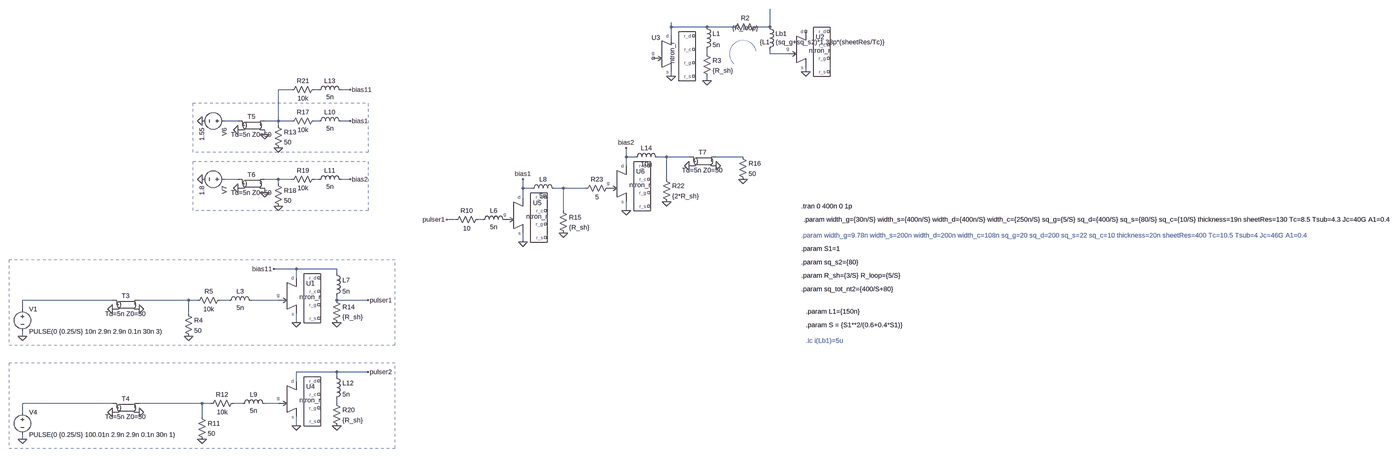
[diagram p0: schematic SNN_ntrons.asc, whole sheet]
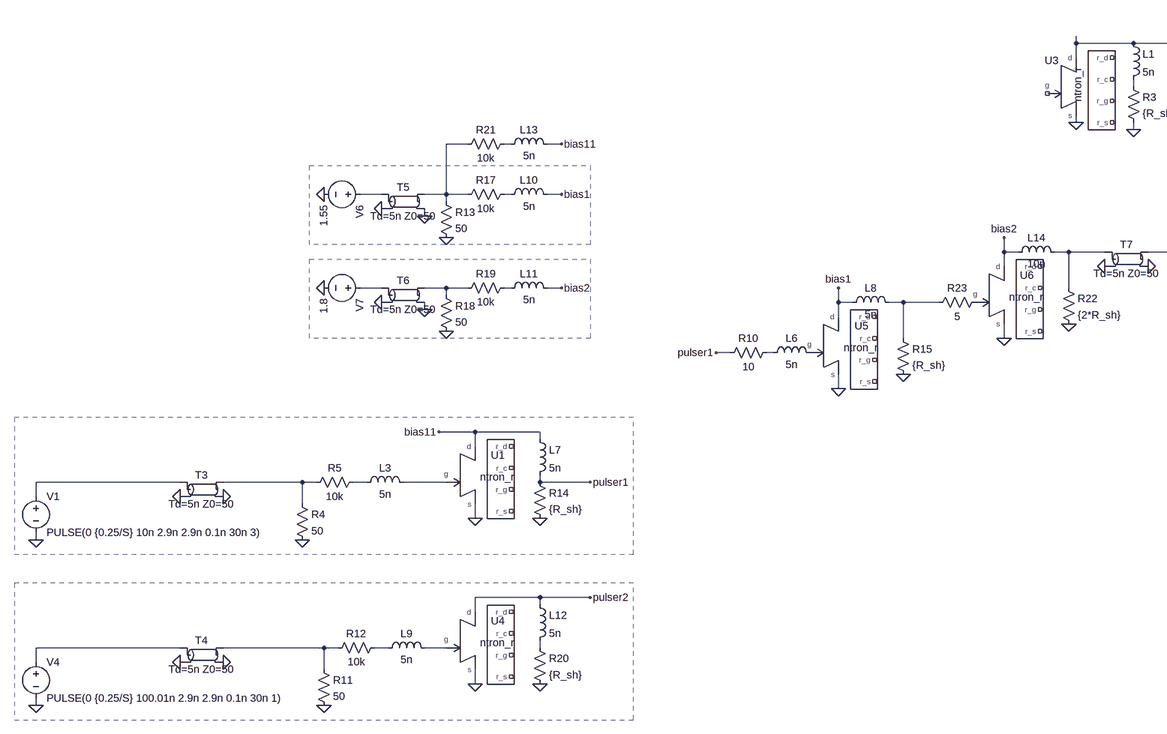
[diagram p1: schematic SNN_ntrons.asc, part, row 1 of 1, column 1 of 2]
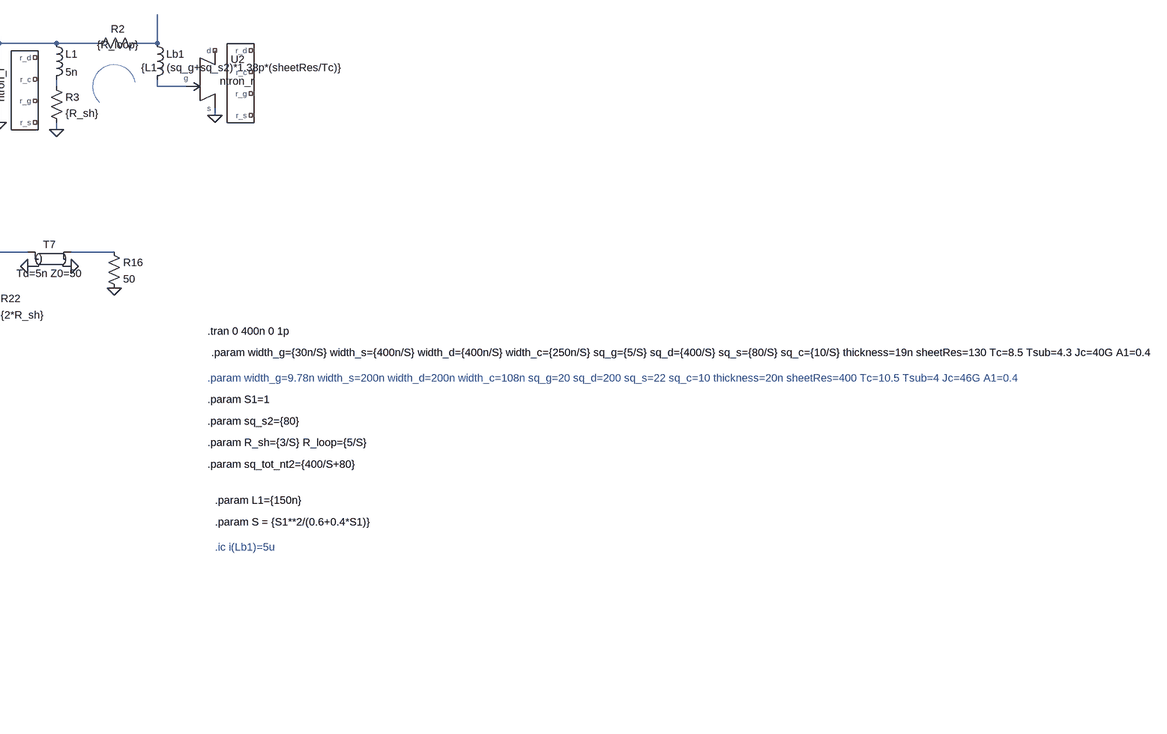
[diagram p2: schematic SNN_ntrons.asc, part, row 1 of 1, column 2 of 2]
SNN_ntrons.asc, the LTspice schematic file:
Version 4
SHEET 1 3684 1588
WIRE -656 80 -656 64
WIRE -528 80 -656 80
WIRE -432 80 -528 80
WIRE -304 80 -304 16
WIRE -304 80 -352 80
WIRE -656 112 -656 80
WIRE -528 176 -528 160
WIRE -304 176 -304 160
WIRE -240 176 -304 176
WIRE -176 240 -176 224
WIRE -656 256 -656 240
WIRE -528 272 -528 256
WIRE -2176 304 -2224 304
WIRE -2080 304 -2096 304
WIRE -1968 304 -2000 304
WIRE -2368 416 -2416 416
WIRE -2224 416 -2224 304
WIRE -2224 416 -2272 416
WIRE -2176 416 -2224 416
WIRE -2080 416 -2096 416
WIRE -1968 416 -2000 416
WIRE -2224 432 -2224 416
WIRE -2272 464 -2272 448
WIRE -816 544 -816 512
WIRE -784 544 -816 544
WIRE -672 544 -704 544
WIRE -592 544 -672 544
WIRE -400 544 -496 544
WIRE -816 576 -816 544
WIRE -2368 624 -2416 624
WIRE -2224 624 -2272 624
WIRE -2176 624 -2224 624
WIRE -2080 624 -2096 624
WIRE -1968 624 -2000 624
WIRE -672 624 -672 544
WIRE -2224 640 -2224 624
WIRE -1184 656 -1184 624
WIRE -1152 656 -1184 656
WIRE -1040 656 -1072 656
WIRE -960 656 -1040 656
WIRE -2272 672 -2272 656
WIRE -1184 688 -1184 656
WIRE -1040 736 -1040 656
WIRE -816 736 -816 704
WIRE -1424 768 -1456 768
WIRE -1328 768 -1344 768
WIRE -1184 848 -1184 816
WIRE -2160 944 -2240 944
WIRE -2016 944 -2160 944
WIRE -2016 960 -2016 944
WIRE -2160 976 -2160 944
WIRE -2816 1056 -3136 1056
WIRE -2544 1056 -2720 1056
WIRE -2512 1056 -2544 1056
WIRE -2400 1056 -2432 1056
WIRE -2224 1056 -2320 1056
WIRE -2016 1056 -2016 1040
WIRE -1904 1056 -2016 1056
WIRE -3136 1088 -3136 1056
WIRE -2544 1104 -2544 1056
WIRE -2160 1136 -2160 1104
WIRE -3136 1184 -3136 1168
WIRE -2016 1312 -2160 1312
WIRE -1904 1312 -2016 1312
WIRE -2016 1328 -2016 1312
WIRE -2160 1344 -2160 1312
WIRE -2816 1424 -3136 1424
WIRE -2496 1424 -2720 1424
WIRE -2464 1424 -2496 1424
WIRE -2352 1424 -2384 1424
WIRE -2224 1424 -2272 1424
WIRE -2016 1424 -2016 1408
WIRE -3136 1456 -3136 1424
WIRE -2496 1472 -2496 1424
WIRE -2160 1504 -2160 1472
WIRE -3136 1552 -3136 1536
FLAG -176 240 0
FLAG -528 272 0
FLAG -2544 1184 0
FLAG -3136 1184 0
FLAG -2720 1088 0
FLAG -2816 1088 0
FLAG -2160 1136 0
FLAG -2016 1136 0
FLAG -2496 1552 0
FLAG -3136 1552 0
FLAG -2720 1456 0
FLAG -2816 1456 0
FLAG -656 256 0
FLAG -2224 512 0
FLAG -2368 448 0
FLAG -2272 464 0
FLAG -2496 416 0
FLAG -1968 416 bias1
FLAG -2224 720 0
FLAG -2368 656 0
FLAG -2272 672 0
FLAG -2496 624 0
FLAG -1968 624 bias2
FLAG -2160 1504 0
FLAG -2016 1504 0
FLAG -1904 1056 pulser1
FLAG -1904 1312 pulser2
FLAG -1184 848 0
FLAG -1040 816 0
FLAG -1456 768 pulser1
FLAG -1184 624 bias1
FLAG -496 576 0
FLAG -592 576 0
FLAG -400 624 0
FLAG -1968 304 bias11
FLAG -2240 944 bias11
FLAG -816 736 0
FLAG -672 704 0
FLAG -816 512 bias2
SYMBOL ind -320 64 R0
WINDOW 3 -20 70 Left 2
SYMATTR InstName Lb1
SYMATTR Value {L1 - (sq_g+sq_s2)*1.38p*(sheetRes/Tc)}
SYMBOL ntron_r -176 160 R0
WINDOW 39 2 131 Invisible 2
WINDOW 3 50 -11 Top 2
WINDOW 0 51 -28 Bottom 2
SYMATTR SpiceLine width_g={width_g} width_s={width_s} width_d={width_d} width_c={width_c} sq_g={sq_g} sq_d={sq_tot_nt2-sq_s2} sq_s={sq_s2} sq_c={sq_c} thickness={thickness} sheetRes={sheetRes} Tc={Tc} Tsub={Tsub} Jc={Jc} A1={A1}
SYMATTR InstName U2
SYMBOL res -544 160 R0
SYMATTR InstName R3
SYMATTR Value {R_sh}
SYMBOL ind -544 64 R0
SYMATTR InstName L1
SYMATTR Value 5n
SYMBOL res -2560 1088 R0
SYMATTR InstName R4
SYMATTR Value 50
SYMBOL res -2528 1072 R270
WINDOW 0 32 56 VTop 2
WINDOW 3 0 56 VBottom 2
SYMATTR InstName R5
SYMATTR Value 10k
SYMBOL ind -2416 1072 R270
WINDOW 0 32 56 VTop 2
WINDOW 3 5 56 VBottom 2
SYMATTR InstName L3
SYMATTR Value 5n
SYMBOL voltage -3136 1072 R0
WINDOW 123 0 0 Left 0
WINDOW 39 0 0 Left 0
SYMATTR InstName V1
SYMATTR Value PULSE(0 {0.25/S} 10n 2.9n 2.9n 0.1n 30n 3)
SYMBOL tline -2768 1072 R0
SYMATTR InstName T3
SYMATTR Value Td=5n Z0=50
SYMBOL res -448 96 R270
WINDOW 0 32 56 VTop 2
WINDOW 3 28 56 VBottom 2
SYMATTR InstName R2
SYMATTR Value {R_loop}
SYMBOL ntron_r -656 176 R0
WINDOW 39 2 131 Invisible 2
WINDOW 3 20 -4 VBottom 2
WINDOW 0 -54 -42 Bottom 2
SYMATTR SpiceLine width_g={width_g} width_s={width_s} width_d={width_d} width_c={width_c} sq_g=10 sq_d={sq_d} sq_s={sq_s} sq_c={sq_c} thickness={thickness} sheetRes={sheetRes} Tc={Tc} Tsub={Tsub} Jc={Jc} A1={A1}
SYMATTR InstName U3
SYMBOL res -2032 1040 R0
SYMATTR InstName R14
SYMATTR Value {R_sh}
SYMBOL ind -2032 944 R0
SYMATTR InstName L7
SYMATTR Value 5n
SYMBOL ntron_r -2160 1040 R0
WINDOW 39 2 131 Invisible 2
WINDOW 3 50 -11 Top 2
WINDOW 0 51 -28 Bottom 2
SYMATTR SpiceLine width_g={width_g} width_s={width_s} width_d={width_d} width_c={width_c} sq_g=10 sq_d={sq_d} sq_s={sq_s} sq_c={sq_c} thickness={thickness} sheetRes={sheetRes} Tc={Tc} Tsub={Tsub} Jc={Jc} A1={A1}
SYMATTR InstName U1
SYMBOL res -2512 1456 R0
SYMATTR InstName R11
SYMATTR Value 50
SYMBOL res -2480 1440 R270
WINDOW 0 32 56 VTop 2
WINDOW 3 0 56 VBottom 2
SYMATTR InstName R12
SYMATTR Value 10k
SYMBOL ind -2368 1440 R270
WINDOW 0 32 56 VTop 2
WINDOW 3 5 56 VBottom 2
SYMATTR InstName L9
SYMATTR Value 5n
SYMBOL voltage -3136 1440 R0
WINDOW 123 0 0 Left 0
WINDOW 39 0 0 Left 0
SYMATTR InstName V4
SYMATTR Value PULSE(0 {0.25/S} 100.01n 2.9n 2.9n 0.1n 30n 1)
SYMBOL tline -2768 1440 R0
SYMATTR InstName T4
SYMATTR Value Td=5n Z0=50
SYMBOL tline -2320 432 R0
SYMATTR InstName T5
SYMATTR Value Td=5n Z0=50
SYMBOL res -2240 416 R0
SYMATTR InstName R13
SYMATTR Value 50
SYMBOL res -2192 432 R270
WINDOW 0 32 56 VTop 2
WINDOW 3 0 56 VBottom 2
SYMATTR InstName R17
SYMATTR Value 10k
SYMBOL ind -2096 432 R270
WINDOW 0 32 56 VTop 2
WINDOW 3 5 56 VBottom 2
SYMATTR InstName L10
SYMATTR Value 5n
SYMBOL voltage -2400 416 R90
WINDOW 123 0 0 Left 0
WINDOW 39 0 0 Left 0
SYMATTR InstName V6
SYMATTR Value 1.55
SYMBOL tline -2320 640 R0
SYMATTR InstName T6
SYMATTR Value Td=5n Z0=50
SYMBOL res -2240 624 R0
SYMATTR InstName R18
SYMATTR Value 50
SYMBOL res -2192 640 R270
WINDOW 0 32 56 VTop 2
WINDOW 3 0 56 VBottom 2
SYMATTR InstName R19
SYMATTR Value 10k
SYMBOL ind -2096 640 R270
WINDOW 0 32 56 VTop 2
WINDOW 3 5 56 VBottom 2
SYMATTR InstName L11
SYMATTR Value 5n
SYMBOL voltage -2400 624 R90
WINDOW 123 0 0 Left 0
WINDOW 39 0 0 Left 0
SYMATTR InstName V7
SYMATTR Value 1.8
SYMBOL res -2032 1408 R0
SYMATTR InstName R20
SYMATTR Value {R_sh}
SYMBOL ind -2032 1312 R0
SYMATTR InstName L12
SYMATTR Value 5n
SYMBOL ntron_r -2160 1408 R0
WINDOW 39 2 131 Invisible 2
WINDOW 3 50 -11 Top 2
WINDOW 0 51 -28 Bottom 2
SYMATTR SpiceLine width_g={width_g} width_s={width_s} width_d={width_d} width_c={width_c} sq_g=10 sq_d={sq_d} sq_s={sq_s} sq_c={sq_c} thickness={thickness} sheetRes={sheetRes} Tc={Tc} Tsub={Tsub} Jc={Jc} A1={A1}
SYMATTR InstName U4
SYMBOL res -1056 720 R0
SYMATTR InstName R15
SYMATTR Value {R_sh}
SYMBOL ind -1168 672 R270
WINDOW 0 32 56 VTop 2
WINDOW 3 5 56 VBottom 2
SYMATTR InstName L8
SYMATTR Value 5n
SYMBOL ntron_r -1184 752 R0
WINDOW 39 2 131 Invisible 2
WINDOW 3 50 -11 Top 2
WINDOW 0 51 -28 Bottom 2
SYMATTR SpiceLine width_g={width_g} width_s={width_s} width_d={width_d} width_c={width_c} sq_g=10 sq_d={sq_d} sq_s={sq_s} sq_c={sq_c} thickness={thickness} sheetRes={sheetRes} Tc={Tc} Tsub={Tsub} Jc={Jc} A1={A1}
SYMATTR InstName U5
SYMBOL ind -1344 784 R270
WINDOW 0 32 56 VTop 2
WINDOW 3 5 56 VBottom 2
SYMATTR InstName L6
SYMATTR Value 5n
SYMBOL res -1328 752 R90
WINDOW 0 0 56 VBottom 2
WINDOW 3 32 56 VTop 2
SYMATTR InstName R10
SYMATTR Value 10
SYMBOL tline -544 560 R0
SYMATTR InstName T7
SYMATTR Value Td=5n Z0=50
SYMBOL res -416 528 R0
SYMATTR InstName R16
SYMATTR Value 50
SYMBOL res -2192 320 R270
WINDOW 0 32 56 VTop 2
WINDOW 3 0 56 VBottom 2
SYMATTR InstName R21
SYMATTR Value 10k
SYMBOL ind -2096 320 R270
WINDOW 0 32 56 VTop 2
WINDOW 3 5 56 VBottom 2
SYMATTR InstName L13
SYMATTR Value 5n
SYMBOL res -688 608 R0
SYMATTR InstName R22
SYMATTR Value {2*R_sh}
SYMBOL ind -800 560 R270
WINDOW 0 32 56 VTop 2
WINDOW 3 5 56 VBottom 2
SYMATTR InstName L14
SYMATTR Value 10n
SYMBOL ntron_r -816 640 R0
WINDOW 39 2 131 Invisible 2
WINDOW 3 50 -11 Top 2
WINDOW 0 51 -28 Bottom 2
SYMATTR SpiceLine width_g={width_g} width_s={width_s} width_d={width_d} width_c={width_c} sq_g=10 sq_d={sq_d} sq_s={sq_s} sq_c={sq_c} thickness={thickness} sheetRes={sheetRes} Tc={Tc} Tsub={Tsub} Jc={Jc} A1={A1}
SYMATTR InstName U6
SYMBOL res -864 640 R90
WINDOW 0 0 56 VBottom 2
WINDOW 3 32 56 VTop 2
SYMATTR InstName R23
SYMATTR Value 5
TEXT -192 720 Left 2 !.tran 0 400n 0 1p
TEXT -176 1200 Left 2 ;.ic i(Lb1)=5u
TEXT -184 768 Left 2 !.param width_g={30n/S} width_s={400n/S} width_d={400n/S} width_c={250n/S} sq_g={5/S} sq_d={400/S} sq_s={80/S} sq_c={10/S} thickness=19n sheetRes=130 Tc=8.5 Tsub=4.3 Jc=40G A1=0.4
TEXT -192 968 Left 2 !.param R_sh={3/S} R_loop={5/S}
TEXT -192 824 Left 2 ;.param width_g=9.78n width_s=200n width_d=200n width_c=108n sq_g=20 sq_d=200 sq_s=22 sq_c=10 thickness=20n sheetRes=400 Tc=10.5 Tsub=4 Jc=46G A1=0.4
TEXT -192 920 Left 2 !.param sq_s2={80}
TEXT -192 1016 Left 2 !.param sq_tot_nt2={400/S+80}
TEXT -176 1096 Left 2 !.param L1={150n}
TEXT -192 872 Left 2 !.param S1=1
TEXT -176 1144 Left 2 !.param S = {S1**2/(0.6+0.4*S1)}
RECTANGLE Normal -1904 528 -2528 352 2
RECTANGLE Normal -1904 736 -2528 560 2
RECTANGLE Normal -3184 1584 -1808 1280 2
RECTANGLE Normal -3184 1216 -1808 912 2
ARC Normal -448 224 -352 128 -331 163 -435 213 2

The netlist it stands for:
* SNN_ntrons.asc
Lb1 N002 N004 {L1 - (sq_g+sq_s2)*1.38p*(sheetRes/Tc)}
XU2 N004 NC_01 0 NC_02 NC_03 NC_04 NC_05 ntron_r ntron_r width_g={width_g} width_s={width_s} width_d={width_d} width_c={width_c} sq_g={sq_g} sq_d={sq_tot_nt2-sq_s2} sq_s={sq_s2} sq_c={sq_c} thickness={thickness} sheetRes={sheetRes} Tc={Tc} Tsub={Tsub} Jc={Jc} A1={A1}  ; pins g d s r_g r_d r_c r_s
R3 N003 0 {R_sh}
L1 N001 N003 5n
R4 N017 0 50
R5 N017 N018 10k
L3 N018 N019 5n
V1 N016 0 PULSE(0 {0.25/S} 10n 2.9n 2.9n 0.1n 30n 3)
T3 N016 0 N017 0 Td=5n Z0=50
R2 N001 N002 {R_loop}
XU3 NC_06 N001 0 NC_07 NC_08 NC_09 NC_10 ntron_r ntron_r width_g={width_g} width_s={width_s} width_d={width_d} width_c={width_c} sq_g=10 sq_d={sq_d} sq_s={sq_s} sq_c={sq_c} thickness={thickness} sheetRes={sheetRes} Tc={Tc} Tsub={Tsub} Jc={Jc} A1={A1}  ; pins g d s r_g r_d r_c r_s
R14 pulser1 0 {R_sh}
L7 bias11 pulser1 5n
XU1 N019 bias11 0 NC_11 NC_12 NC_13 NC_14 ntron_r ntron_r width_g={width_g} width_s={width_s} width_d={width_d} width_c={width_c} sq_g=10 sq_d={sq_d} sq_s={sq_s} sq_c={sq_c} thickness={thickness} sheetRes={sheetRes} Tc={Tc} Tsub={Tsub} Jc={Jc} A1={A1}  ; pins g d s r_g r_d r_c r_s
R11 N021 0 50
R12 N021 N022 10k
L9 N022 N023 5n
V4 N020 0 PULSE(0 {0.25/S} 100.01n 2.9n 2.9n 0.1n 30n 1)
T4 N020 0 N021 0 Td=5n Z0=50
T5 N007 0 N005 0 Td=5n Z0=50
R13 N005 0 50
R17 N005 N008 10k
L10 N008 bias1 5n
V6 N007 0 1.55
T6 N011 0 N012 0 Td=5n Z0=50
R18 N012 0 50
R19 N012 N013 10k
L11 N013 bias2 5n
V7 N011 0 1.8
R20 N024 0 {R_sh}
L12 pulser2 N024 5n
XU4 N023 pulser2 0 NC_15 NC_16 NC_17 NC_18 ntron_r ntron_r width_g={width_g} width_s={width_s} width_d={width_d} width_c={width_c} sq_g=10 sq_d={sq_d} sq_s={sq_s} sq_c={sq_c} thickness={thickness} sheetRes={sheetRes} Tc={Tc} Tsub={Tsub} Jc={Jc} A1={A1}  ; pins g d s r_g r_d r_c r_s
R15 N014 0 {R_sh}
L8 bias1 N014 5n
XU5 P001 bias1 0 NC_19 NC_20 NC_21 NC_22 ntron_r ntron_r width_g={width_g} width_s={width_s} width_d={width_d} width_c={width_c} sq_g=10 sq_d={sq_d} sq_s={sq_s} sq_c={sq_c} thickness={thickness} sheetRes={sheetRes} Tc={Tc} Tsub={Tsub} Jc={Jc} A1={A1}  ; pins g d s r_g r_d r_c r_s
L6 N015 P001 5n
R10 N015 pulser1 10
T7 N009 0 N010 0 Td=5n Z0=50
R16 N010 0 50
R21 N005 N006 10k
L13 N006 bias11 5n
R22 N009 0 {2*R_sh}
L14 bias2 N009 10n
XU6 P002 bias2 0 NC_23 NC_24 NC_25 NC_26 ntron_r ntron_r width_g={width_g} width_s={width_s} width_d={width_d} width_c={width_c} sq_g=10 sq_d={sq_d} sq_s={sq_s} sq_c={sq_c} thickness={thickness} sheetRes={sheetRes} Tc={Tc} Tsub={Tsub} Jc={Jc} A1={A1}  ; pins g d s r_g r_d r_c r_s
R23 P002 N014 5
.tran 0 400n 0 1p
* .ic i(Lb1)=5u
.param width_g={30n/S} width_s={400n/S} width_d={400n/S} width_c={250n/S} sq_g={5/S} sq_d={400/S} sq_s={80/S} sq_c={10/S} thickness=19n sheetRes=130 Tc=8.5 Tsub=4.3 Jc=40G A1=0.4
.param R_sh={3/S} R_loop={5/S}
* .param width_g=9.78n width_s=200n width_d=200n width_c=108n sq_g=20 sq_d=200 sq_s=22 sq_c=10 thickness=20n sheetRes=400 Tc=10.5 Tsub=4 Jc=46G A1=0.4
.param sq_s2={80}
.param sq_tot_nt2={400/S+80}
.param L1={150n}
.param S1=1
.param S = {S1**2/(0.6+0.4*S1)}
.lib ntron_2.lib
.backanno
.end